# Altium schematic sheet Symmetric_PS.SchDoc
size A3; Organization: Altium Limited; Address1: L3, 12a Rodborough Rd; Address2: Frenchs Forest; Address3: NSW; Address4: Australia 2086
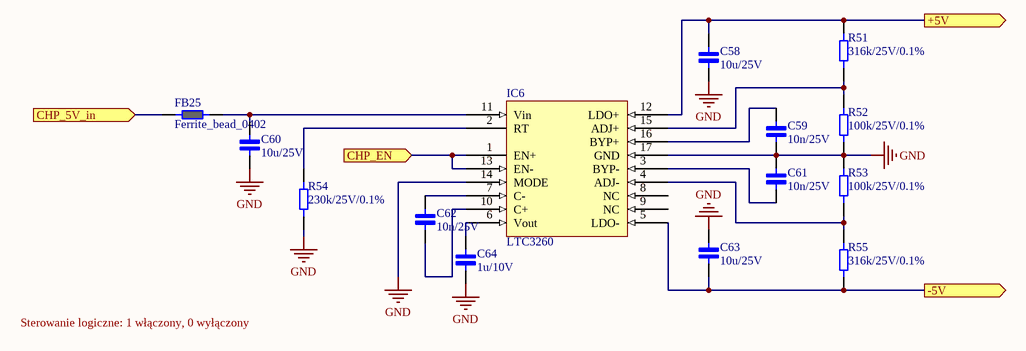
[diagram p0: Symmetric_PS.SchDoc]

## Parts
C58  10u/25V  [CAP_0805]
C59  10n/25V  [Cap_0402]
C60  10u/25V  [CAP_0805]
C61  10n/25V  [Cap_0402]
C62  10n/25V  [Cap_0402]
C63  10u/25V  [CAP_0805]
C64  1u/10V  [Cap_0402]
FB25  Ferrite_bead_0402  [FERRITE_0402]
IC6  LTC3260  [MSOP-16]
R51  316k/25V/0.1%  [RES_0402]
R52  100k/25V/0.1%  [RES_0402]
R53  100k/25V/0.1%  [RES_0402]
R54  230k/25V/0.1%  [RES_0402]
R55  316k/25V/0.1%  [RES_0402]

## Ports
+5V (out), -5V (out), CHP_5V_in (in), CHP_EN (in)

## Nets
GND: C58.1 C59.1 C60.1 C61.2 C63.2 C64.1 IC6.14(MODE) IC6.17(GND) R52.1 R53.2 R54.1
+5V: C58.2 IC6.12(LDO+) R51.2 ; port +5V
-5V: C63.1 IC6.5(LDO-) R55.1 ; port -5V
CHP_5V_in: FB25.1 ; port CHP_5V_in
CHP_EN: IC6.1(EN+) IC6.13(EN-) ; port CHP_EN
NetC59_2: C59.2 IC6.16(BYP+)
NetC60_2: C60.2 FB25.2 IC6.11(Vin)
NetC61_1: C61.1 IC6.3(BYP-)
NetC62_1: C62.1 IC6.10(C+)
NetC62_2: C62.2 IC6.7(C-)
NetC64_2: C64.2 IC6.6(Vout)
NetIC6_2: IC6.2(RT) R54.2
NetIC6_4: IC6.4(ADJ-) R53.1 R55.2
NetIC6_15: IC6.15(ADJ+) R51.1 R52.2

Not connected (* = marked no-connect by the designer): IC6 8(NC) 9(NC)

## Notes on the sheet
- Sterowanie logiczne: 1 włączony, 0 wyłączony
- Title
- Size:
- Date:
- A3
- Number:
- Time:
- Revision:
- Sheet
- of
- File:

## Library data of the parts
C58 C60 C63 = Cap_0805_10u_25v: Ceramic Capacitor 10uF / 0805 / 25V / ±5%, Wurth Elektronik MLCC
C59 C61 C62 = Cap_0402_10n: Ceramic Capacitor 10n / 0402 / 25V / ±5%, Wurth Elektronik MLCC; ComponentLink1Description: New link; ComponentLink1URL: https://www.we-online.com/catalog/en/WCAP-CSGP-25VDC
C64 = Cap_0402_1u: Ceramic Capacitor 1uF / 0402 / 10V / ±5%, Wurth Elektronik MLCC
FB25 = Ferrite_bead_0402: Ferrite bead, wurth 74269241102
IC6 = LTC3260: Charge pump, low noise; ComponentLink1Description: New link; ComponentLink1URL: https://pl.mouser.com/datasheet/2/609/3260fa-1271271.pdf
R51 R55 = Res_0402_316k: Vishay, thin film resistor 316k/25V/0.1%
R52 R53 = Res_0402_100k: Vishay, thin film resistor 100k/25V/0.1%
R54 = Res_0402_230k: Vishay, thin film resistor 230k/25V/0.1%